# EAGLE design UI (EAGLE 9.2.2)
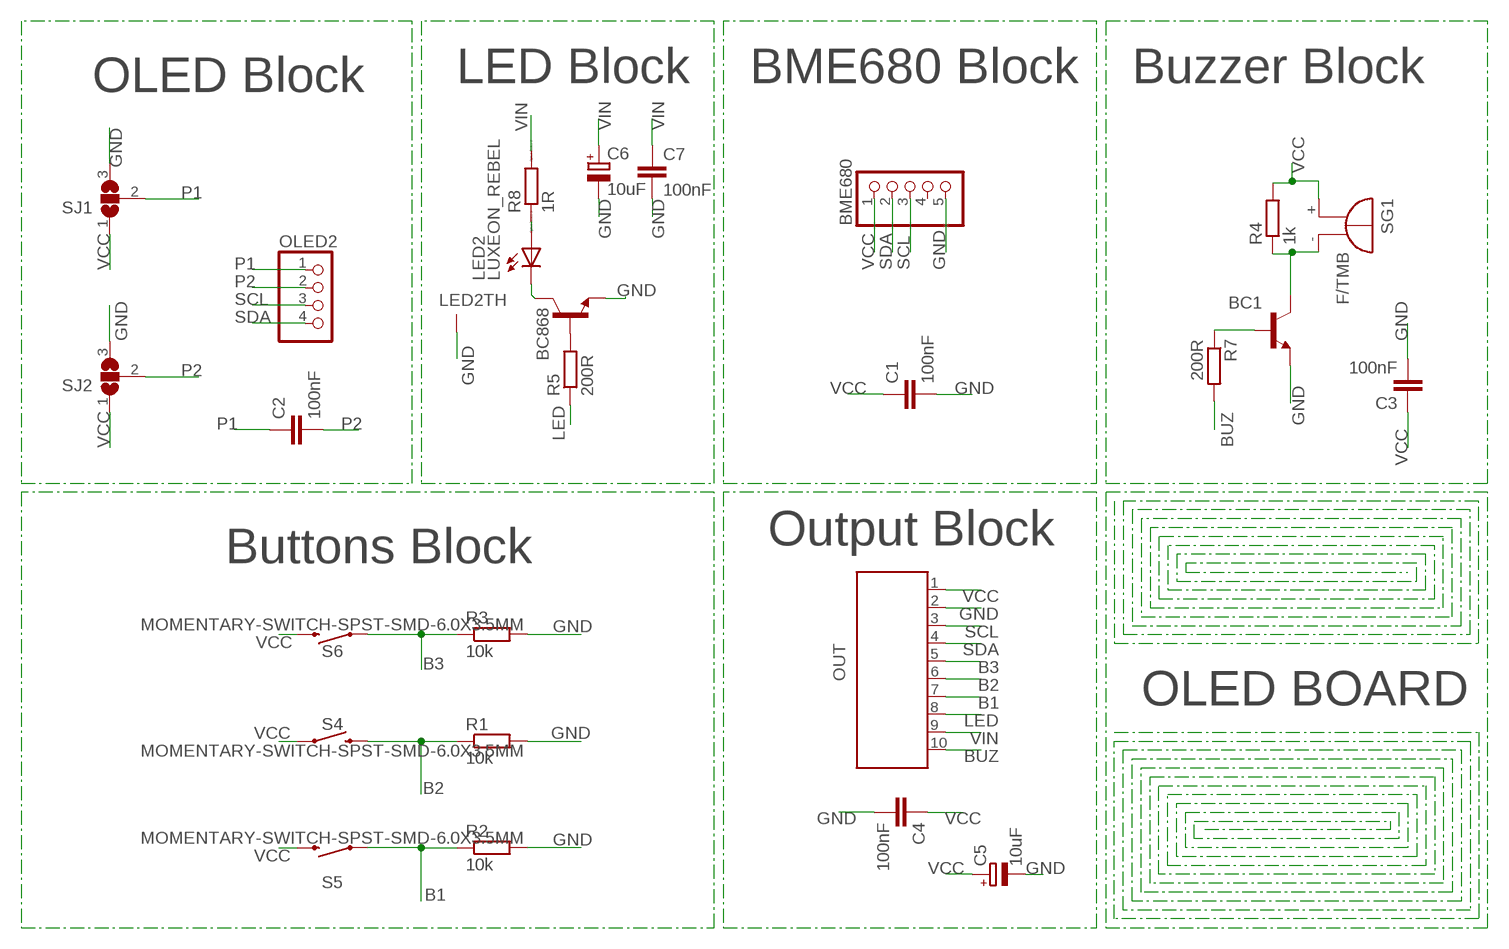
[diagram p0: schematic, sheet 1]

## Parts
BC1  BC868-NPN-SOT89-BCE  [SOT89-BCE]
BC868  BC868-NPN-SOT89-BCE  [SOT89-BCE]
BME680  PINHD-1X5  [1X05]
C1  100nF  C-EUC0805  [C0805]
C2  100nF  C-EUC0805  [C0805]
C3  100nF  C-EUC0805  [C0805]
C4  100nF  C-EUC1808  [C1808]
C5  10uF  CPOL-EUSMCA  [SMC_A]
C6  10uF  CPOL-EUSMCA  [SMC_A]
C7  100nF  C-EUC0805  [C0805]
LED2  LUXEON_REBEL  [LUXEON_REBEL]
OLED2  PINHD-1X4  [1X04]
OUT  686110183422  [686110183422]
R1  10k  R-EU_M1206  [M1206]
R2  10k  R-EU_M1206  [M1206]
R3  10k  R-EU_M1206  [M1206]
R4  1k  R-EU_M0805  [M0805]
R5  200R  R-EU_M0805  [M0805]
R7  200R  R-EU_M0805  [M0805]
R8  1R  RR3216  [R3216]
S4  MOMENTARY-SWITCH-SPST-SMD-6.0X3.5MM  [TACTILE_SWITCH_SMD_6.0X3.5MM]
S5  MOMENTARY-SWITCH-SPST-SMD-6.0X3.5MM  [TACTILE_SWITCH_SMD_6.0X3.5MM]
S6  MOMENTARY-SWITCH-SPST-SMD-6.0X3.5MM  [TACTILE_SWITCH_SMD_6.0X3.5MM]
SG1  F/TMB  [F/TMB]
SJ1  SJ2W  [SJ_2]
SJ2  SJ2W  [SJ_2]

## Nets
B1: OUT.7 R2.1 S5.1
B2: OUT.6 R1.1 S4.2
B3: OUT.5 R3.1 S6.1
BUZ: OUT.10 R7.2
GND: BC1.E BC868.E BME680.5 C1.2 C3.2 C4.2 C5.- C6.- C7.2 LED2.TH LED2.TH@1(TH) LED2.TH@2(TH) LED2.TH@3(TH) LED2.TH@4(TH) OUT.2 R1.2 R2.2 R3.2 SJ1.3 SJ2.3
LED: OUT.8 R5.1
N$1: LED2.A LED2.A@1(A) R8.1
N$2: BC868.C LED2.C LED2.C@1(C)
N$3: BC868.B R5.2
N$7: BC1.B R7.1
N$8: BC1.C R4.1 SG1.-
P1: C2.1 OLED2.1 SJ1.2
P2: C2.2 OLED2.2 SJ2.2
SCL: BME680.3 OLED2.3 OUT.3
SDA: BME680.2 OLED2.4 OUT.4
VCC: BME680.1 C1.1 C3.1 C4.1 C5.+ OUT.1 R4.2 S4.1 S5.2 S6.2 SG1.+ SJ1.1 SJ2.1
VIN: C6.+ C7.1 OUT.9 R8.2
Unconnected: BME680.4

## Notes on the sheet
- OLED Block | LED Block | BME680 Block | Buzzer Block
- Output Block
- Buttons Block
- OLED BOARD

## Library data of the parts
BC1 BC868 = transistor:*-NPN-: NPN Transistror BF959 corrected 2008.03.06
BME680 = pinhead:PINHD-1X5: PIN HEADER
C1-C4 C7 = rcl:C-EU: CAPACITOR, European symbol; SPICEPREFIX: C
C5 C6 = rcl:CPOL-EU: POLARIZED CAPACITOR, European symbol; SPICEPREFIX: C
LED2 = led-lumiled:LUXEON_REBEL: LUXEON Rebel Display layer 93, Pins, and connect all contact points with a net. The thermal pads are defined in a separate gate with addlevel REQUEST. Draw a net named 'TH' and connect all thermal pads with it. Please read the Package's Description about DRC settings. Source: http://www.lumileds.com/pdfs/AB32.pdf; OC_FARNELL: unknown; OC_NEWARK: unknown
OLED2 = pinhead:PINHD-1X4: PIN HEADER
OUT = Wurth_Elektronik_Electromechanic_FPC_Connectors_&_Flat_Flexible_Cable_rev18c:686110183422: 686110183422 WR-FPC 1.00mm SMT Horizontal Top Contact - Low Profile <http://katalog.we-online.de/media/images/v2/Family_WR-FPC_6861xx183422.jpg> Details see: http://katalog.we-online.de/en/em/FPC_1_00_SMT_ZIF_HORIZONTAL_TOP_CONTACT_LOW_PROFILE_6861xx183422 Created by Yingchun,shan 2016 (C) Wurth Elektronik
R1-R5 R7 = rcl:R-EU_: RESISTOR, European symbol; SPICEPREFIX: 10K
R8 = eagle-ltspice:R: RESISTOR, European symbol; SPICEMODEL: NONE; SPICEPREFIX: R
S4-S6 = SparkFun-Switches:MOMENTARY-SWITCH-SPST: Momentary Switch (Pushbutton) - SPST Normally-open (NO) SPST momentary switches (buttons, pushbuttons). Variants PTH-12MM - 12mm square, through-hole Momentary Pushbutton Switch - 12mm Square <https://www.sparkfun.com/products/9190> (COM-09190) PTH-6.0MM, PTH-6.0MM-KIT - 6.0mm square, through-hole Mini Pushbutton Switch <https://www.sparkfun.com/products/97> (COM-00097) KIT package intended for soldering kit's - only one side of pads' copper is exposed. PTH-RIGHT-ANGLE-KIT - Right-angle, through-hole Right Angle Tactile Button <https://www.sparkfun.com/products/10791> - Used on SparkFun BigTime Watch Kit <https://www.sparkfun.com/products/11734> SMD-12MM - 12mm square, surface-mount Tactile Button - SMD (12mm) <https://www.sparkfun.com/products/12993> (COM-12993) Used on SparkFun PicoBoard <https://www.sparkfun.com/products/11888> SMD-4.5MM - 4.5mm Square Trackball Switch Used on SparkFun Blackberry Trackballer Breakout <https://www.sparkfun.com/products/13169> SMD-4.6MMX2.8MM - 4.60mm x 2.80mm, surface mount Used on SparkFun SAMD21 Mini Breakout <https://www.sparkfun.com/products/13664> SMD-5.2MM, SMD-5.2-REDUNDANT - 5.2mm square, surface-mount Mini Pushbutton Switch - SMD <https://www.sparkfun.com/products/8720> (COM-08720) Used on Arduino Pro Mini <https://www.sparkfun.com/products/11114> REDUNDANT package connects both switch circuits together SMD-6.0X3.5MM - 6.0 x 3.5mm, surface mount Momentary Reset Switch SMD <https://www.sparkfun.com/products/8229> (COM-08229) SMD-6.2MM-TALL - 6.2mm square, surface mount Tactile Button - SMD (6mm) <https://www.sparkfun.com/products/12992> Used on SparkFun Digital Sandbox <https://www.sparkfun.com/products/12651> SMD-RIGHT-ANGLE - Right-angle, surface mount Used on SparkFun Block for Intel® Edison - Arduino <https://www.sparkfun.com/products/13036>; PROD_ID: SWCH-00815; SF_SKU: COM-08229
SG1 = buzzer:F/TMB: BUZZER Source: Buerklin; OC_FARNELL: unknown; OC_NEWARK: unknown
SJ1 SJ2 = jumper:SJ2W: SMD solder JUMPER

## Net classes
0 default: width 0.254 mm, drill 0.508 mm, clearance 0.254 mm

## Board
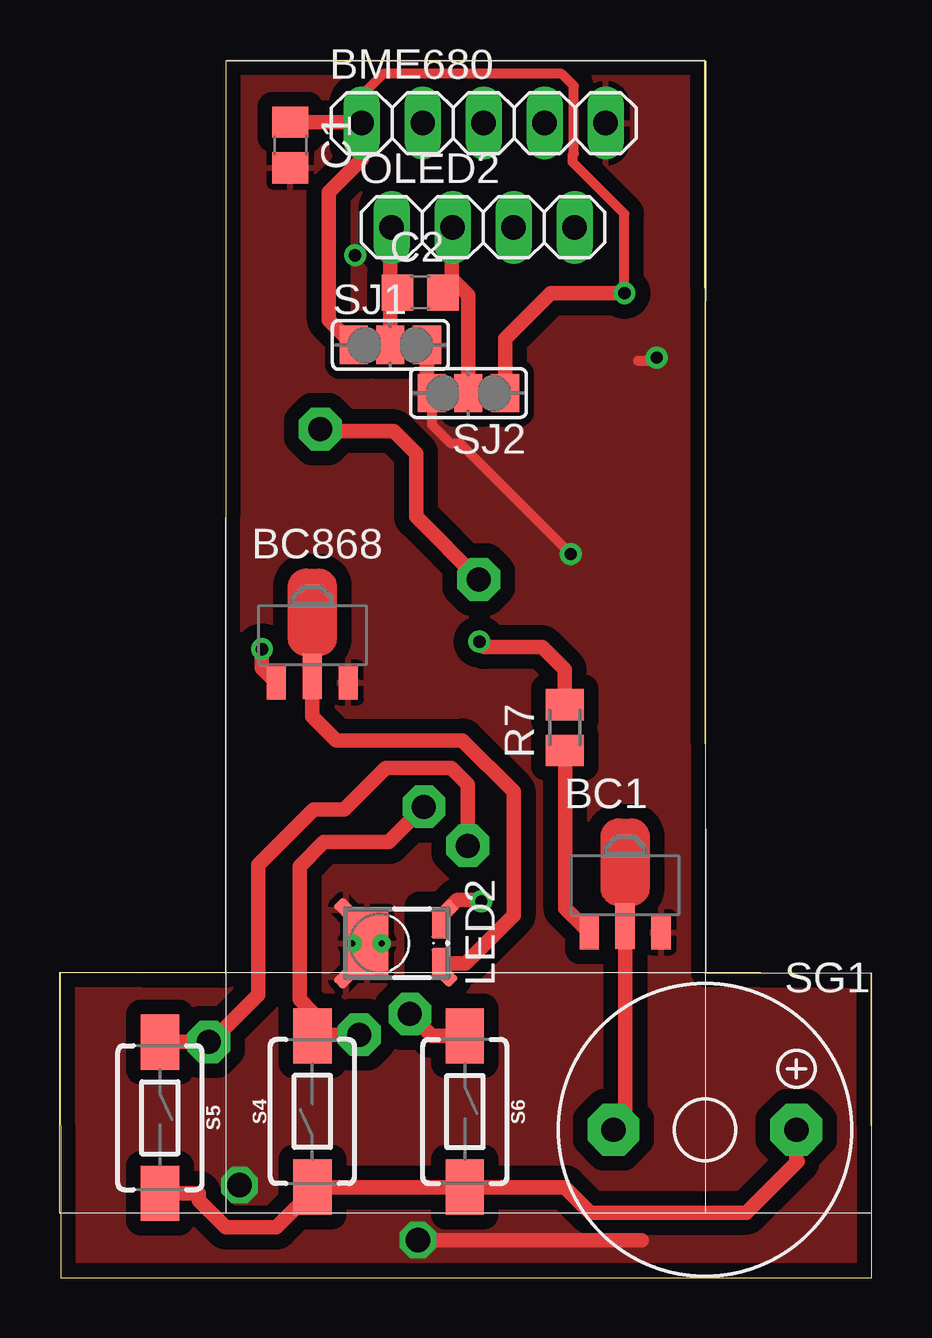
[diagram p1: board, top side]
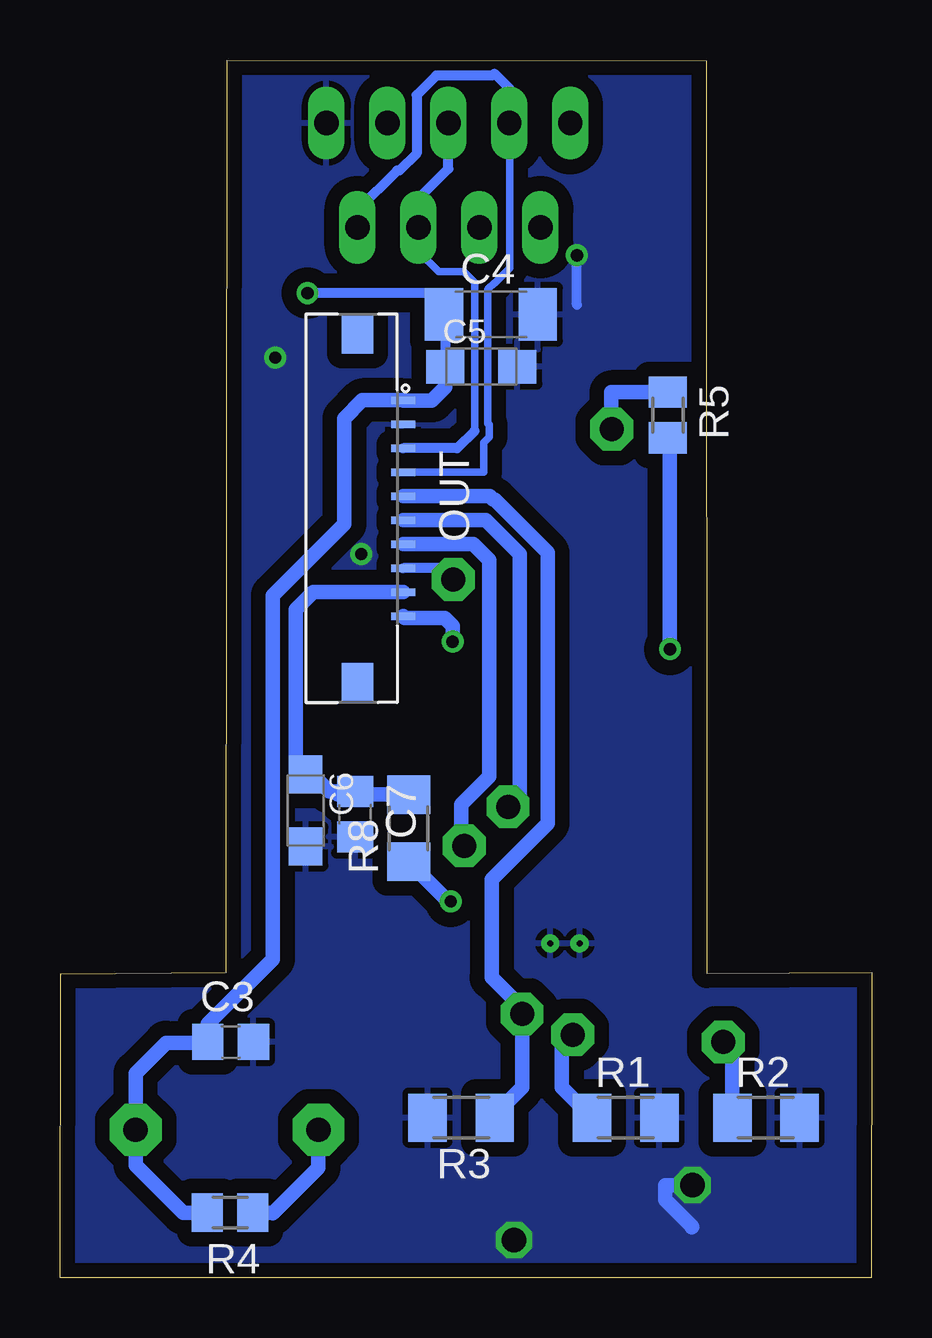
[diagram p2: board, bottom side, seen from below]

Size 33.83 x 50.76 mm. Coordinates in mm from the lower left corner, seen from the top.
Outline: 0.03,0 33.83,0 33.81,12.68 26.9,12.73 26.87,50.76 6.91,50.74 6.88,12.7 0,12.73 0.03,0
Copper layers (1*16): Top 0.035mm / dielectric 1.5mm / Bottom 0.035mm
Design rules "default *": minimum track width 8mil, minimum drill 0.3mm, track to track 8mil, track to pad 8mil, pad to pad 8mil, via to via 8mil, smd to smd 8mil, copper to edge 10mil, drill to drill 6mil, minimum pad ring 10mil, minimum via ring 8mil, stop-mask expansion 4mil, vias tented up to drill 0mil, thermal gap 10mil

### Footprints (pad centres in the part's own frame; a part is rotated, then mirrored left to right if it is on the bottom)
SOT89-BCE = smd 0.8 x 1.4: B -1.499,-1.981; E 1.499,-1.981 | smd 0.8 x 1.9: C 0,-1.727
1X05 = drill 1.016 long: 1 -5.08,0; 2 -2.54,0; 3 0,0; 4 2.54,0; 5 5.08,0
C0805 = smd 1.3 x 1.5: 1 -0.95,0; 2 0.95,0
C1808 = smd 1.6 x 2.2: 1 -1.95,0; 2 1.95,0
SMC_A = smd 1.6 x 1.4: + -1.5,0; - 1.5,0
LUXEON_REBEL = smd 1.2 x 0.67: A 0.8,-2.51; C -0.8,-2.51 | smd 1 x 0.6 rotated 315: A@1 1.31,-2.75 | smd 1 x 0.6 rotated 225: C@1 -1.31,-2.75 | smd 2.8 x 1.77: TH 0,0.51 | smd 1 x 0.6 rotated 135: TH@1 -1.39,1.39 | smd 1 x 0.6 rotated 45: TH@2 1.39,1.39 | drill 0.25 pad 0.4: TH@3 0,-0.095; TH@4 0,1.125
1X04 = drill 1.016 long: 1 -3.81,0; 2 -1.27,0; 3 1.27,0; 4 3.81,0
686110183422 = smd 0.3 x 1: 1 -4.5,1.9; 2 -3.5,1.9; 3 -2.5,1.9; 4 -1.5,1.9; 5 -0.5,1.9; 6 0.5,1.9; 7 1.5,1.9; 8 2.5,1.9; 9 3.5,1.9; 10 4.5,1.9 | smd 1.65 x 1.3: Z1 -7.275,0; Z2 7.275,0
M1206 = smd 1.6 x 2: 1 -1.4,0; 2 1.4,0
M0805 = smd 1.3 x 1.6: 1 -0.95,0; 2 0.95,0
R3216 = smd 1.6 x 1.8: 1 -1.4,0; 2 1.4,0
TACTILE_SWITCH_SMD_6.0X3.5MM = smd 2.3 x 1.6: 1 -3.15,0; 2 3.15,0
F/TMB = drill 1.016 pad 2.159 octagon: + 3.81,0; - -3.81,0
SJ_2 = smd 1.168 x 1.6: 1 -1.524,0; 2 0,0; 3 1.524,0

### Placement (x,y rotation side)
BC1  23.55,16.38 0 top
BC868  10.52,26.8 0 top
BME680  17.65,48.13 0 top
C1  9.6,47.22 270 top
C2  15.01,41.07 0 top
C3  26.72,9.83 0 bottom
C4  15.88,40.16 0 bottom
C5  16.28,37.97 0 bottom
C6  23.6,19.48 270 bottom
C7  21.54,19.33 270 bottom
LED2  13.31,13.94 90 top
OLED2  17.63,43.79 0 top
OUT  21.44,32.08 270 bottom
R1  10.26,6.68 0 bottom
R2  4.42,6.68 0 bottom
R3  17.12,6.68 180 bottom
R4  26.75,2.72 180 bottom
R5  8.51,35.97 270 bottom
R7  21.03,22.94 90 top
R8  19.3,18.75 90 bottom
S4  10.52,6.93 90 top
S5  4.17,6.68 270 top
S6  16.87,6.93 270 top
SG1  26.87,6.17 0 top
SJ1  13.77,38.89 0 top
SJ2  17.02,36.88 180 top

### Tracks (layer width: path | path; a pad name or v marks a point on that pad's centre or on a via)
B1  (via drill 1 pad 1.78)
  Top 0.254: 6.3,9.83 v6.2,9.83
  Top 0.61: v6.2,9.83 S5.1 | 6.3,9.83 8.25,11.79 8.25,17.22 10.57,19.53 11.84,19.53 13.56,21.26 16.31,21.26 16.99,20.57 v16.99,18.01
  Bottom 0.61: v6.2,9.83 5.82,9.45 R2.1 | v16.99,18.01 16.97,18.03 16.97,18.64 17.12,18.8 17.12,19.73 15.95,20.89 15.95,29.92 16.61,30.58 OUT.7
B2  (via drill 1 pad 1.78)
  Top 0.254: 10.26,10.74 10.26,10.34 S4.2
  Top 0.61: 10.26,10.74 10.87,10.13 v12.47,10.13 10.57,10.13 S4.2 10.52,11.07 9.98,11.61 9.98,17.15 11,18.16 13.69,18.16 v15.16,19.63
  Bottom 0.254: 12.93,10.11 12.91,10.13 v12.47,10.13
  Bottom 0.61: 12.93,10.11 12.93,7.95 R1.1 | v15.16,19.63 14.68,20.12 14.68,30.18 16.09,31.58 OUT.6
B3  (via drill 1 pad 1.78)
  Top 0.61: v14.58,11 15.49,10.08 S6.1
  Bottom 0.254: 14.58,11.25 v14.58,11 | 15.72,6.81 R3.1
  Bottom 0.61: 14.58,11.25 15.85,12.52 15.85,16.61 13.51,18.95 13.51,30.23 15.73,32.44 15.79,32.44 15.93,32.58 OUT.5 | v14.58,11 14.58,7.95 15.72,6.81
BUZ  (via drill 0.51)
  Top 0.61: R7.2 21.03,25.35 20.09,26.29 17.68,26.29 17.68,26.31 v17.48,26.52
  Bottom 0.61: v17.48,26.52 17.48,27.18 17.81,27.51 19.47,27.51 OUT.10
GND  (via drill 0.51, 1.02)
  Top 0.406: 15.29,37.08 SJ2.3 15.49,35.56 16.26,34.8 16.66,34.8 v21.28,30.18 | 24.08,38.23 24.69,38.23 24.82,38.35 v24.87,38.35
  Top 0.61: v14.91,1.58 24.23,1.58 | 15.29,37.08 SJ1.3
  Bottom 0.406: v24.87,38.35 24.79,38.43 24.79,38.53 | C5.- 14.78,38.08 | 12.29,40.56 v12.29,42.62
  Bottom 0.61: 7.52,2.11 7.49,2.13 8.61,3.25 8.61,3.86 v7.48,3.86
  pour Top (isolate 0.61): -30.33,60.6 -30.33,-13.87 -22.1,-22.1 51.13,-22.1 61.82,-11.4 61.82,54.31 53.04,58.67 arc-90 49.73,61.98 49.73,66.4 -26.09,66.4 -29.16,63.32 -29.16,61.77
  pour Bottom (isolate 0.61): -29.31,60.86 -29.31,-16.18 -23.39,-22.1 -23.16,-22.33 53.31,-22.33 62.92,-12.73 62.92,53.8 50.98,65.74 49.73,65.74 -25.73,65.74 -27.71,63.75 -27.71,62.43 -29.29,60.86
LED  (via drill 1 pad 1.78)
  Top 0.61: v17.45,29.11 14.83,31.72 14.83,34.37 13.9,35.3 10.93,35.3 v10.85,35.38
  Bottom 0.406: v17.45,29.11 17.92,29.58 OUT.8
  Bottom 0.61: v10.85,35.38 10.85,36.91 10.85,36.92 R5.1
N$1  (via drill 0.51)
  Top 0.61: LED2.A@1 16.55,15.75 17.5,15.75 v17.55,15.7
  Bottom 0.61: v17.55,15.7 17.66,15.7 R8.1
N$2
  Top 0.61: LED2.C@1 16.06,13.11 16.9,13.11 18.9,15.11 18.9,20.27 16.76,22.4 11.51,22.4 10.52,23.39 BC868.C
N$3  (via drill 0.51)
  Top 0.61: v8.42,26.2 8.42,25.42 BC868.B
  Bottom 0.305: 8.42,34.92 R5.2
  Bottom 0.61: v8.42,26.2 8.42,34.92
N$7
  Top 0.61: BC1.B 21.06,15.39 21.06,21.96 R7.1
N$8
  Top 0.61: BC1.C 23.55,6.66 SG1.-
  Bottom 0.61: SG1.- 23.06,4.6 24.97,2.69 24.99,2.72 R4.1
P1
  Top 0.254: 13.77,43.74 OLED2.1
  Top 0.406: C2.1 13.93,41.2 13.77,41.2
  Top 0.61: 13.77,43.74 13.77,41.2 SJ1.2
P2
  Top 0.254: 16.33,43.76 OLED2.2
  Top 0.406: C2.2 16.33,41.44
  Top 0.61: SJ2.2 17.02,40.97 16.33,41.66 | 16.33,41.66 16.33,43.76 | 16.33,41.44 16.33,41.66
SCL
  Bottom 0.305: 16.56,35.31 16.56,41.49 17.01,41.94 18.06,41.94 18.9,42.77 OLED2.3
  Bottom 0.406: OLED2.3 18.9,44.98 17.65,46.23 BME680.3 | 16.56,35.31 17.29,34.58 OUT.3
SDA
  Bottom 0.305: 15.09,48.08 15.09,42.1 15.72,41.46 15.75,41.46 15.99,41.23 15.99,41.2 16,41.18 16,35.61 15.95,35.56 15.95,35.05 16.18,34.83 16.18,33.58 OUT.4
  Bottom 0.406: OLED2.4 21.44,44.5 19.79,46.15 19.69,46.15 18.97,46.87 18.97,49.3 18.16,50.11 15.83,50.11 15.75,50.19 15.72,50.19 15.11,49.58 BME680.2 15.09,48.11 15.09,48.08
VCC  (via drill 0.51)
  Top 0.406: 12.54,48.17 BME680.1 12.55,48.16 | v23.52,41.05 23.52,44.35 21.36,46.51 21.36,46.82 21.41,46.87 21.41,49.68 20.9,50.19 13.46,50.19 12.55,49.28 | 30.73,4.85 30.68,4.9
  Top 0.61: C1.1 12.54,48.17 | SJ1.1 11.2,39.93 11.2,45.26 12.57,46.63 BME680.1 | SJ2.1 18.54,39.14 20.45,41.05 v23.52,41.05 | 12.55,49.28 12.55,48.16 | S5.2 5.79,3.53 5.79,3.23 6.91,2.11 9.02,2.11 10.69,3.78 | S4.1 10.69,3.78 | 10.69,3.78 S6.2 21.03,3.78 22.1,2.72 28.6,2.72 30.73,4.85 | 30.68,4.9 SG1.+
  Bottom 0.406: 27.67,10.58 C3.1 | C5.+ 17.78,40.16 C4.1 17.71,41.05 v23.52,41.05 | OUT.1
  Bottom 0.61: R4.2 28.7,2.72 30.68,4.7 SG1.+ 30.68,8.53 29.41,9.8 27.7,9.8 C3.1 | 27.67,10.58 24.97,13.28 24.97,28.45 21.99,31.43 21.99,35.82 21.23,36.58 OUT.1 | C5.+ 17.78,37.13 18.34,36.58 OUT.1
VIN
  Bottom 0.61: OUT.9 23.29,28.58 24,27.86 24,21.67 | 22.13,20.27 22.61,20.27 24,21.67 | 22.13,20.27 C7.1 | R8.2 22.26,20.15 22.13,20.27 | C6.+ 24,21.39 24,21.67